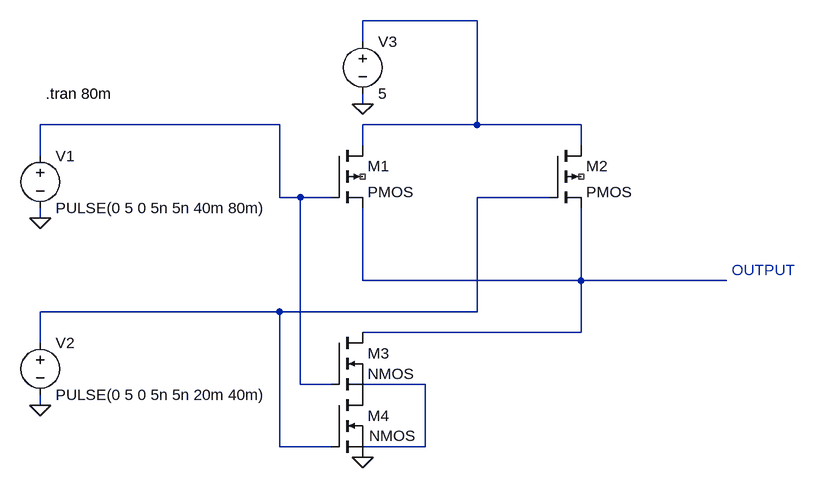
[diagram p0: schematic nand-gate-ltspice.asc]
nand-gate-ltspice.asc, the LTspice schematic file:
Version 4
SHEET 1 1380 680
WIRE 896 -96 720 -96
WIRE 720 -64 720 -96
WIRE 720 32 720 16
WIRE 592 64 224 64
WIRE 896 64 896 -96
WIRE 896 64 720 64
WIRE 1056 64 896 64
WIRE 720 96 720 64
WIRE 1056 96 1056 64
WIRE 224 112 224 64
WIRE 592 176 592 64
WIRE 624 176 592 176
WIRE 672 176 624 176
WIRE 1008 176 896 176
WIRE 224 208 224 192
WIRE 720 304 720 192
WIRE 1056 304 1056 192
WIRE 1056 304 720 304
WIRE 1280 304 1056 304
WIRE 592 352 224 352
WIRE 896 352 896 176
WIRE 896 352 592 352
WIRE 1056 384 1056 304
WIRE 1056 384 720 384
WIRE 224 400 224 352
WIRE 624 464 624 176
WIRE 672 464 624 464
WIRE 816 464 720 464
WIRE 224 496 224 480
WIRE 592 560 592 352
WIRE 672 560 592 560
WIRE 816 560 816 464
WIRE 816 560 720 560
FLAG 720 32 0
FLAG 224 208 0
FLAG 224 496 0
FLAG 720 576 0
SYMBOL voltage 224 96 R0
SYMATTR InstName V1
SYMATTR Value PULSE(0 5 0 5n 5n 40m 80m)
SYMBOL voltage 224 384 R0
SYMATTR InstName V2
SYMATTR Value PULSE(0 5 0 5n 5n 20m 40m)
SYMBOL voltage 720 -80 R0
SYMATTR InstName V3
SYMATTR Value 5
SYMBOL nmos 672 384 R0
WINDOW 3 56 64 Left 2
SYMATTR InstName M3
SYMBOL nmos 672 480 R0
WINDOW 3 58 63 Left 2
SYMATTR InstName M4
SYMBOL pmos4 672 96 R0
SYMATTR InstName M1
SYMBOL pmos4 1008 96 R0
SYMATTR InstName M2
TEXT 1288 288 Left 2 ;OUTPUT
TEXT 232 16 Left 2 !.tran 80m

The netlist it stands for:
* nand-gate-ltspice.asc
V1 N002 0 PULSE(0 5 0 5n 5n 40m 80m)
V2 N003 0 PULSE(0 5 0 5n 5n 20m 40m)
V3 N001 0 5
M3 N004 N002 P001 P001 NMOS
M4 P001 N003 0 0 NMOS
M1 N001 N002 N004 NC_01 PMOS
M2 N001 N003 N004 NC_02 PMOS
.model NMOS NMOS
.model PMOS PMOS
.lib standard.mos
* OUTPUT
.tran 80m
.backanno
.end